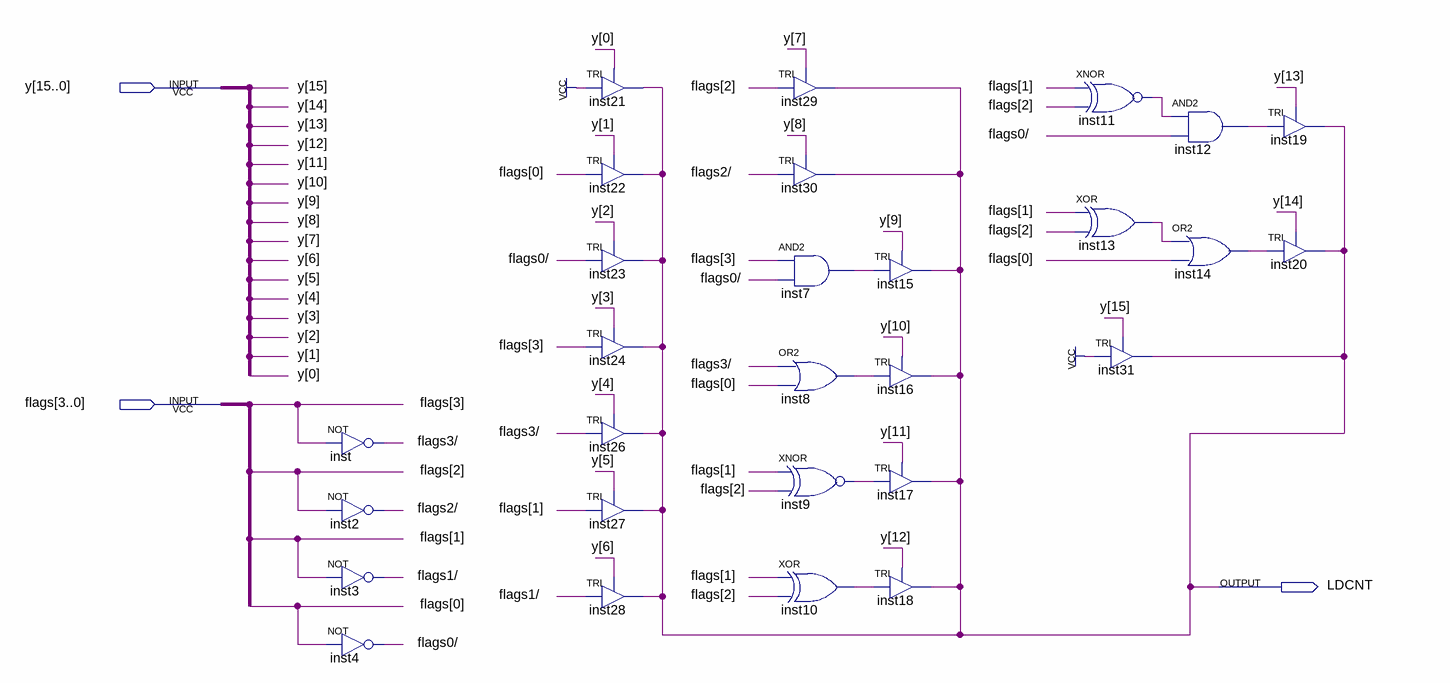
[diagram p0: schematic sheet]
// Quartus schematic decod_inst_dsv_calc_LDCNT.bdf as structural Verilog: 28 symbols, 3 pins
module decod_inst_dsv_calc_LDCNT (
  input  [15:0] y,
  input  [3:0] flags,
  output LDCNT
);

  wire \flags0/ , \flags1/ , \flags2/ , \flags3/ , inst7_out, inst8_out, inst9_out, inst10_out, inst11_out,
       inst12_out, inst13_out, inst14_out;

  not inst (\flags3/ , flags[3]);
  not inst2 (\flags2/ , flags[2]);
  not inst3 (\flags1/ , flags[1]);
  not inst4 (\flags0/ , flags[0]);
  TRI inst21 (.IN(1'b1), .OE(y[0]), .OUT(LDCNT));
  TRI inst22 (.IN(flags[0]), .OE(y[1]), .OUT(LDCNT));
  TRI inst23 (.IN(\flags0/ ), .OE(y[2]), .OUT(LDCNT));
  TRI inst24 (.IN(flags[3]), .OE(y[3]), .OUT(LDCNT));
  TRI inst26 (.IN(\flags3/ ), .OE(y[4]), .OUT(LDCNT));
  TRI inst27 (.IN(flags[1]), .OE(y[5]), .OUT(LDCNT));
  TRI inst28 (.IN(\flags1/ ), .OE(y[6]), .OUT(LDCNT));
  TRI inst29 (.IN(flags[2]), .OE(y[7]), .OUT(LDCNT));
  TRI inst30 (.IN(\flags2/ ), .OE(y[8]), .OUT(LDCNT));
  and inst7 (inst7_out, flags[3], \flags0/ );
  or inst8 (inst8_out, \flags3/ , flags[0]);
  xnor inst9 (inst9_out, flags[1], flags[2]);
  xor inst10 (inst10_out, flags[1], flags[2]);
  TRI inst15 (.IN(inst7_out), .OE(y[9]), .OUT(LDCNT));
  TRI inst16 (.IN(inst8_out), .OE(y[10]), .OUT(LDCNT));
  TRI inst17 (.IN(inst9_out), .OE(y[11]), .OUT(LDCNT));
  TRI inst18 (.IN(inst10_out), .OE(y[12]), .OUT(LDCNT));
  xnor inst11 (inst11_out, flags[1], flags[2]);
  xor inst13 (inst13_out, flags[1], flags[2]);
  TRI inst31 (.IN(1'b1), .OE(y[15]), .OUT(LDCNT));
  and inst12 (inst12_out, inst11_out, \flags0/ );
  or inst14 (inst14_out, inst13_out, flags[0]);
  TRI inst19 (.IN(inst12_out), .OE(y[13]), .OUT(LDCNT));
  TRI inst20 (.IN(inst14_out), .OE(y[14]), .OUT(LDCNT));
endmodule
